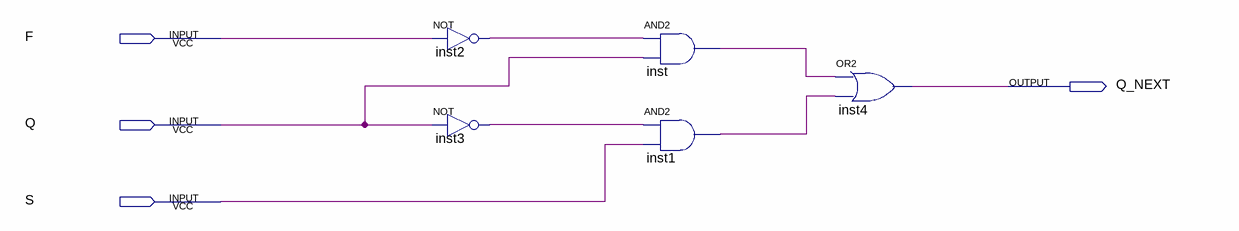
[diagram p0: schematic sheet]
// Quartus schematic NEXT_STATE.bdf as structural Verilog: 5 symbols, 4 pins
module NEXT_STATE (
  input  F,
  input  Q,
  input  S,
  output Q_NEXT
);

  wire inst1_out, inst2_out, inst3_out, inst_out;

  not inst2 (inst2_out, F);
  not inst3 (inst3_out, Q);
  and inst (inst_out, inst2_out, Q);
  and inst1 (inst1_out, inst3_out, S);
  or inst4 (Q_NEXT, inst_out, inst1_out);
endmodule
